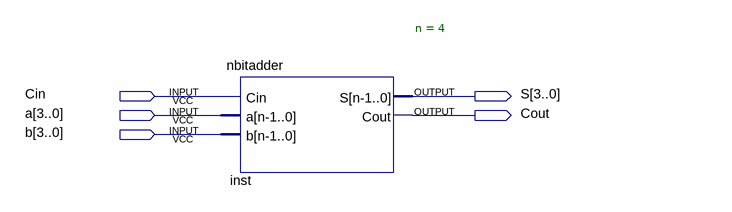
[diagram p0: schematic sheet]
// Quartus schematic top.bdf as structural Verilog: 1 symbols, 5 pins
module top (
  input  Cin,
  input  [3:0] a,
  input  [3:0] b,
  output [3:0] S,
  output Cout
);

  nbitadder #(.n(4)) inst (.Cin(Cin), .a(a), .b(b), .S(S), .Cout(Cout));
endmodule
